# Altium schematic sheet 02-ESP-WROOM-32.SchDoc: ESP32, LCD, I2C IOs  and USB
size A3; SheetNumber: 3; SheetTotal: 6
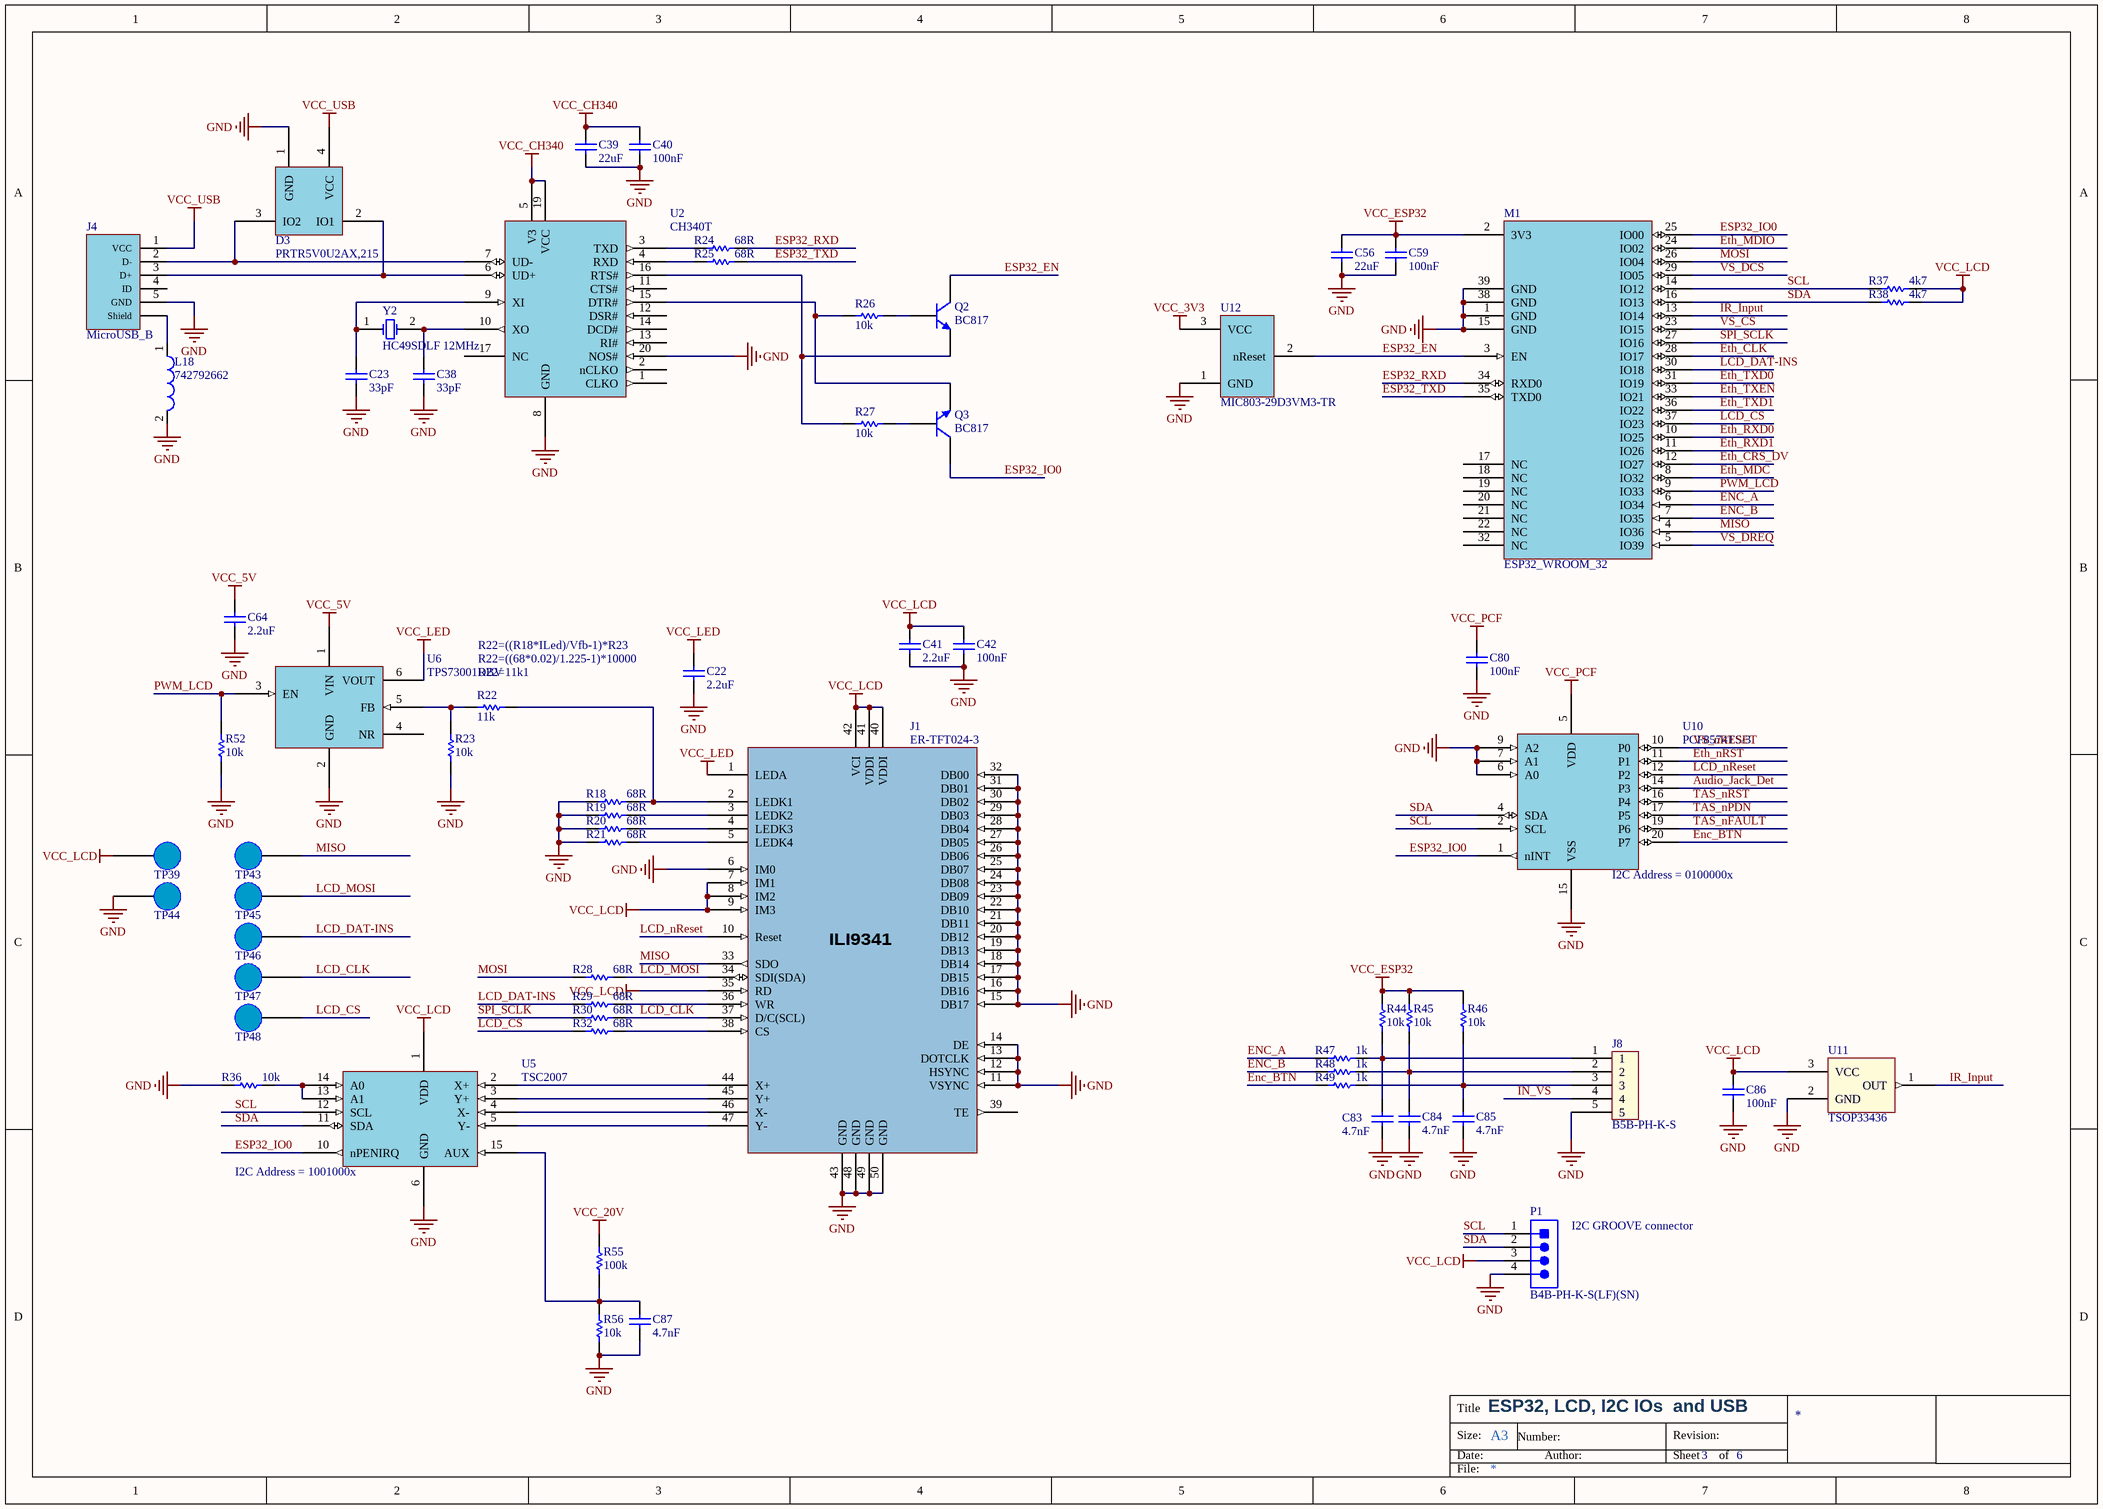
[diagram p0: 02-ESP-WROOM-32.SchDoc]

## Parts
C22  value 2.2uF  [CAPC1608X06N]  (hidden comment: 2.2uF 10V 0603 X5R)
C23  value 33pF  [CAPC1608X06N]  (hidden comment: 33pF 50V 0603 NP0)
C38  value 33pF  [CAPC1608X06N]  (hidden comment: 33pF 50V 0603 NP0)
C39  value 22uF  [CAPC1608X06N]  (hidden comment: 22uF 6.3V 0603 X5R)
C40  value 100nF  [CAPC1608X06N]  (hidden comment: 100nF 25V 0603 X5R)
C41  value 2.2uF  [CAPC1608X06N]  (hidden comment: 2.2uF 10V 0603 X5R)
C42  value 100nF  [CAPC1608X06N]  (hidden comment: 100nF 25V 0603 X5R)
C56  value 22uF  [CAPC1608X06N]  (hidden comment: 22uF 6.3V 0603 X5R)
C59  value 100nF  [CAPC1608X06N]  (hidden comment: 100nF 25V 0603 X5R)
C64  value 2.2uF  [CAPC1608X06N]  (hidden comment: 2.2uF 10V 0603 X5R)
C80  value 100nF  [CAPC1608X06N]  (hidden comment: 100nF 25V 0603 X5R)
C83  value 4.7nF  [CAPC1608X06N]  (hidden comment: 4.7nF 50V 0603 X7R)
C84  value 4.7nF  [CAPC1608X06N]  (hidden comment: 4.7nF 50V 0603 X7R)
C85  value 4.7nF  [CAPC1608X06N]  (hidden comment: 4.7nF 50V 0603 X7R)
C86  value 100nF  [CAPC1608X06N]  (hidden comment: 100nF 25V 0603 X5R)
C87  value 4.7nF  [CAPC1608X06N]  (hidden comment: 4.7nF 50V 0603 X7R)
D3  PRTR5V0U2AX,215  [SOT190P230X120-4N]
J1  ER-TFT024-3  [62684-501100ALF]
J4  MicroUSB_B  [629105150521]
J8  B5B-PH-K-S  [JST-B5B-PH-K-S_V]
L18  742792662  [CAPC0603(1608)]
M1  ESP32_WROOM_32  [ESP-WROOM-32]
P1  B4B-PH-K-S(LF)(SN)  [JST-B4B-PH-K-S_V]
Q2  BC817  [SOT95P230X110-3N]
Q3  BC817  [SOT95P230X110-3N]
R18  value 68R  [RESC1608X06N]  (hidden comment: 68R_0603)
R19  value 68R  [RESC1608X06N]  (hidden comment: 68R_0603)
R20  value 68R  [RESC1608X06N]  (hidden comment: 68R_0603)
R21  value 68R  [RESC1608X06N]  (hidden comment: 68R_0603)
R22  value 11k  [RESC1608X06N]  (hidden comment: 11k_0603)
R23  value 10k  [RESC1608X06N]  (hidden comment: 10k_0603)
R24  value 68R  [RESC1608X06N]  (hidden comment: 68R_0603)
R25  value 68R  [RESC1608X06N]  (hidden comment: 68R_0603)
R26  value 10k  [RESC1608X06N]  (hidden comment: 10k_0603)
R27  value 10k  [RESC1608X06N]  (hidden comment: 10k_0603)
R28  value 68R  [RESC1608X06N]  (hidden comment: 68R_0603)
R29  value 68R  [RESC1608X06N]  (hidden comment: 68R_0603)
R30  value 68R  [RESC1608X06N]  (hidden comment: 68R_0603)
R32  value 68R  [RESC1608X06N]  (hidden comment: 68R_0603)
R36  value 10k  [RESC1608X06N]  (hidden comment: 10k_0603)
R37  value 4k7  [RESC1608X06N]  (hidden comment: 4k7_0603)
R38  value 4k7  [RESC1608X06N]  (hidden comment: 4k7_0603)
R44  value 10k  [RESC1608X06N]  (hidden comment: 10k_0603)
R45  value 10k  [RESC1608X06N]  (hidden comment: 10k_0603)
R46  value 10k  [RESC1608X06N]  (hidden comment: 10k_0603)
R47  value 1k  [RESC1608X06N]  (hidden comment: 1k_0603)
R48  value 1k  [RESC1608X06N]  (hidden comment: 1k_0603)
R49  value 1k  [RESC1608X06N]  (hidden comment: 1k_0603)
R52  value 10k  [RESC1608X06N]  (hidden comment: 10k_0603)
R55  value 100k  [RESC1608X06N]  (hidden comment: 100k_0603)
R56  value 10k  [RESC1608X06N]  (hidden comment: 10k_0603)
TP39  TP_1mm  [TP_1mm]  (value not drawn)  (no BOM)
TP43  TP_1mm  [TP_1mm]  (value not drawn)  (no BOM)
TP44  TP_1mm  [TP_1mm]  (value not drawn)  (no BOM)
TP45  TP_1mm  [TP_1mm]  (value not drawn)  (no BOM)
TP46  TP_1mm  [TP_1mm]  (value not drawn)  (no BOM)
TP47  TP_1mm  [TP_1mm]  (value not drawn)  (no BOM)
TP48  TP_1mm  [TP_1mm]  (value not drawn)  (no BOM)
U2  CH340T  [TSOP65P780X120-20N]
U5  TSC2007  [TSOP65P640X120-16N]
U6  TPS73001DBV  [SOT95P245X110-6N]
U10  PCF8574TS/3  [TSOP65P640X120-20N]
U11  TSOP33436  [TSOP332]
U12  MIC803-29D3VM3-TR  [SOT95P230X110-3N]
Y2  HC49SDLF 12MHz  [TXC 9C]

## Nets
GND: C22.1 C23.1 C38.1 C39.2 C40.2 C41.1 C42.2 C56.2 C59.2 C64.1 C80.2 C83.1 C84.1 C85.1 C86.2 C87.1 D3.1(GND) J1.6(IM0) J1.11(VSYNC) J1.12(HSYNC) J1.13(DOTCLK) J1.14(DE) J1.15(DB17) J1.16(DB16) J1.17(DB15) J1.18(DB14) J1.19(DB13) J1.20(DB12) J1.21(DB11) J1.22(DB10) J1.23(DB09) J1.24(DB08) J1.25(DB07) J1.26(DB06) J1.27(DB05) J1.28(DB04) J1.29(DB03) J1.30(DB02) J1.31(DB01) J1.32(DB00) J1.43(GND) J1.48(GND) J1.49(GND) J1.50(GND) J4.5(GND) J8.5 L18.2 M1.1(GND) M1.15(GND) M1.38(GND) M1.39(GND) P1.4 R18.1 R19.1 R20.1 R21.1 R23.1 R36.2 R52.1 R56.1 TP44.1 U2.8(GND) U2.20(NOS#) U5.6(GND) U6.2(GND) U10.6(A0) U10.7(A1) U10.9(A2) U10.15(VSS) U11.2(GND) U12.1(GND)
VCC_3V3: U12.3(VCC)
VCC_5V: C64.2 U6.1(VIN)
VCC_20V: R55.2
VCC_CH340: C39.1 C40.1 U2.5(V3) U2.19(VCC)
VCC_ESP32: C56.1 C59.1 M1.2(3V3) R44.2 R45.2 R46.2
VCC_LCD: C41.2 C42.1 C86.1 J1.7(IM1) J1.8(IM2) J1.9(IM3) J1.35(RD) J1.40(VDDI) J1.41(VDDI) J1.42(VCI) P1.3 R37.2 R38.2 TP39.1 U5.1(VDD) U11.3(VCC)
VCC_LED: C22.2 J1.1(LEDA) U6.6(VOUT)
VCC_PCF: C80.1 U10.5(VDD)
VCC_USB: D3.4(VCC) J4.1(VCC)
Audio_Jack_Det: U10.14(P3)
ENC_A: M1.6(IO34) R47.1
ENC_B: M1.7(IO35) R48.1
Enc_BTN: R49.1 U10.20(P7)
ESP32_EN: M1.3(EN) Q2.3(C) U12.2(nReset)
ESP32_IO0: M1.25(IO00) Q3.3(C) U5.10(nPENIRQ) U10.1(nINT)
ESP32_RXD: M1.34(RXD0) R24.2
ESP32_TXD: M1.35(TXD0) R25.2
Eth_CLK: M1.28(IO17)
Eth_CRS_DV: M1.12(IO27)
Eth_MDC: M1.8(IO32)
Eth_MDIO: M1.24(IO02)
Eth_nRST: U10.11(P1)
Eth_RXD0: M1.10(IO25)
Eth_RXD1: M1.11(IO26)
Eth_TXD0: M1.31(IO19)
Eth_TXD1: M1.36(IO22)
Eth_TXEN: M1.33(IO21)
IN_VS: J8.4
IR_Input: M1.13(IO14) U11.1(OUT)
LCD_CLK: J1.37(D/C(SCL)) R30.2 TP47.1
LCD_CS: M1.37(IO23) R32.1 TP48.1
LCD_DAT-INS: M1.30(IO18) R29.1 TP46.1
LCD_MOSI: J1.34(SDI(SDA)) R28.2 TP45.1
LCD_nReset: J1.10(Reset) U10.12(P2)
MISO: J1.33(SDO) M1.4(IO36) TP43.1
MOSI: M1.26(IO04) R28.1
PWM_LCD: M1.9(IO33) R52.2 U6.3(EN)
SCL: M1.14(IO12) P1.1 R37.1 U5.12(SCL) U10.2(SCL)
SDA: M1.16(IO13) P1.2 R38.1 U5.11(SDA) U10.4(SDA)
SPI_SCLK: M1.27(IO16) R30.1
TAS_nFAULT: U10.19(P6)
TAS_nPDN: U10.17(P5)
TAS_nRST: U10.16(P4)
VS_CS: M1.23(IO15)
VS_DCS: M1.29(IO05)
VS_DREQ: M1.5(IO39)
VS_nRESET: U10.10(P0)
NetC23_2: C23.2 U2.9(XI) Y2.1(OSC1)
NetC38_2: C38.2 U2.10(XO) Y2.2(OSC2)
NetC83_2: C83.2 J8.1 R44.1 R47.2
NetC84_2: C84.2 J8.2 R45.1 R48.2
NetC85_2: C85.2 J8.3 R46.1 R49.2
NetC87_2: C87.2 R55.1 R56.2 U5.15(AUX)
NetD3_2: D3.2(IO1) J4.3(D+) U2.6(UD+)
NetD3_3: D3.3(IO2) J4.2(D-) U2.7(UD-)
NetJ1_2: J1.2(LEDK1) R18.2 R22.2
NetJ1_3: J1.3(LEDK2) R19.2
NetJ1_4: J1.4(LEDK3) R20.2
NetJ1_5: J1.5(LEDK4) R21.2
NetJ1_36: J1.36(WR) R29.2
NetJ1_38: J1.38(CS) R32.2
NetJ1_44: J1.44(X+) U5.2(X+)
NetJ1_45: J1.45(Y+) U5.3(Y+)
NetJ1_46: J1.46(X-) U5.4(X-)
NetJ1_47: J1.47(Y-) U5.5(Y-)
NetJ4_Shell: J4.Shell(Shield) L18.1
NetQ2_1: Q2.1(B) R26.1
NetQ2_2: Q2.2(E) R27.2 U2.16(RTS#)
NetQ3_1: Q3.1(B) R27.1
NetQ3_2: Q3.2(E) R26.2 U2.15(DTR#)
NetR22_1: R22.1 R23.2 U6.5(FB)
NetR24_1: R24.1 U2.3(TXD)
NetR25_1: R25.1 U2.4(RXD)
NetR36_1: R36.1 U5.13(A1) U5.14(A0)

Not connected (* = marked no-connect by the designer): J1 39(TE); J4 4(ID); M1 17(NC) 18(NC) 19(NC) 20(NC) 21(NC) 22(NC) 32(NC); U2 1(CLKO) 2(nCLKO) 11(CTS#) 12(DSR#) 13(RI#) 14(DCD#) 17(NC); U6 4(NR)

## Notes on the sheet
- R22=((R18*ILed)/Vfb-1)*R23
- R22=((68*0.02)/1.225-1)*10000
- (near R22) R22=11k1
- (near U10) I2C Address = 0100000x
- (near U5) I2C Address = 1001000x
- (near P1) I2C GROOVE connector
- Title
- Size:
- Date:
- A3
- Number:
- Author:
- Revision:
- Sheet
- of
- File:
- (in symbol ER-TFT024-3) ILI9341

## Library data of the parts
C22 C41 C64 = 2.2uF 10V 0603 X5R: Tolerance: 10%; Voltage: 10V; Supplier1: Digikey; Supplier2: Mouser; Supplier3: Farnell; RefSupplier1: 1276-1085-1-ND; RefSupplier2: *; RefSupplier3: *; Case: 0603; Material: X5R
C23 C38 = 33pF 50V 0603 NP0: Tolerance: 10%; Voltage: 50V; Supplier1: Digikey; Supplier2: Mouser; Supplier3: Farnell; RefSupplier1: 490-1415-1-ND; RefSupplier2: *; RefSupplier3: *; Case: 0603; Material: NP0
C39 C56 = 22uF 6.3V 0603 X5R: Tolerance: 10%; Voltage: 6.3V; Supplier1: Digikey; Supplier2: Mouser; Supplier3: Farnell; RefSupplier1: 445-8028-2-ND; RefSupplier2: *; RefSupplier3: *; Case: 0603; Material: X5R
C40 C42 C59 C80 C86 = 100nF 25V 0603 X5R: Tolerance: 10%; Voltage: 25V; Supplier1: Digikey; Supplier2: Mouser; Supplier3: Farnell; RefSupplier1: 587-1245-1-ND; RefSupplier2: *; RefSupplier3: *; Case: 0603; Material: X5R
C83-C85 C87 = 4.7nF 50V 0603 X7R: Tolerance: 10%; Voltage: 50V; Supplier1: Digikey; Supplier2: Mouser; Supplier3: Farnell; RefSupplier1: 490-12741-1-ND; RefSupplier2: *; RefSupplier3: *; Case: 0603; Material: X7R
D3 = PRTR5V0U2AX,215: Ultra low capacitance double rail-to-rail ESD protection diode; Manufacturer: Nexperia; PartNumber: PRTR5V0U2AX,215; Case: SOT-143-B
J1 = ER-TFT024-3: Connector for 240x320 dots 2.4" color tft lcd module; Manufacturer: Amphenol FCI; PartNumber: 62684-501100ALF
J4 = MicroUSB_B: Micro USB 2.0 SMT Type B Horizontal; Manufacturer: Wurth Elektronik; PartNumber: 629105150521
J8 = B5B-PH-K-S: JST  B5B-PH 2mm Pitch 5pins TH; Manufacturer: JST; PartNumber: B5B-PH-K-S
L18 = CMP-0220-00178-1: SMD EMI Suppression Ferrite Bead WE-CBF, Z = 1000 Ohm; Manufacturer: Wurth; PackageDescription: Chip Inductor, 2-Leads, Body 1.6 x 0.8 mm; PackageVersion: 2009; PackageReference: SMD-0603; ComponentLink1URL: http://www.we-online.com; ComponentLink2URL: http://www.we-online.de/katalog/media/pdf/742792662.pdf; Impedance: 1000 Ohm; DatasheetVersion: ver 1, Mar-2010; ComponentLink1Description: Manufacturer Link; ComponentLink2Description: Datasheet; RefManufacturer: 742792662
M1 = ESP32_WROOM_32: Manufacturer: Espressif Systems; PartNumber: ESP32_WROOM_32
P1 = CMP-2000-05165-1: Male Header, Pitch 2 mm, 1 x 4 Position; Manufacturer: JST; No of Positions: 4; Style/Orientation: StraightHeader/Plug; Pitch: 2mm; Datasheet URL: http://datasheet.octopart.com/B4B-PH-K-S%28LF%29%28SN%29-JST-datasheet-10558886.pdf; Type: ShroudedHeader; Manufacturer URL: http://www.jst.com/home2.html; Termination: Crimp; Datasheet Version: Apr-09; PartNumber: B4B-PH-K-S(LF)(SN)
Q2 Q3 = BC817_SOT23: BC817 NPN  45V SOT23; PartNumber: BC817-40,215; Manufacturer: Nexperia; Case: SOT23; Supplier1: Digikey; RefSupplier1: 1727-2919-1-ND
R18-R21 R24 R25 R28-R30 R32 = 68R: Resistor 68R 0603 1%; Case: 0603; Tolerance: 1%; Size: 0603, 1.6x0.8x0.8mm; RefSupplier1: 311-68.0HRCT-ND; RefSupplier2: *; RefSupplier3: *; Supplier1: Digikey; Supplier2: *; Supplier3: *
R22 = 11k: Resistor 11k 0603 1%; Case: 0603; Tolerance: 1%; Size: 0603, 1.6x0.8x0.8mm; RefSupplier1: 311-11KGRCT-ND; RefSupplier2: *; RefSupplier3: *; Supplier1: Digikey; Supplier2: *; Supplier3: *
R23 R26 R27 R36 R44-R46 R52 R56 = 10k: Resistor 10k 0603 1%; Case: 0603; Tolerance: 1%; Size: 0603, 1.6x0.8x0.8mm; RefSupplier1: 311-10.0KHRCT-ND; RefSupplier2: *; RefSupplier3: *; Supplier1: Digikey; Supplier2: *; Supplier3: *
R37 R38 = 4k7: Resistor 4k7 0603 1%; Case: 0603; Tolerance: 1%; Size: 0603, 1.6x0.8x0.8mm; Supplier1: Digikey; Supplier2: *; Supplier3: *; RefSupplier1: 311-4.70KHRCT-ND; RefSupplier2: *; RefSupplier3: *
R47-R49 = 1k: Resistor 1k 0603 1%; Case: 0603; Tolerance: 1%; Size: 0603, 1.6x0.8x0.8mm; Supplier1: Digikey; Supplier2: Mouser; Supplier3: Farnell; RefSupplier1: 311-1.00KHRCT-ND; RefSupplier2: *; RefSupplier3: *
R55 = 100k: Resistor 100k 0603 1%; Case: 0603; Tolerance: 1%; Supplier1: Digikey; Supplier2: *; Supplier3: *; RefSupplier1: 311-100KHRCT-ND; RefSupplier2: *; RefSupplier3: *
TP39 TP43-TP48 = TP_1mm: Test point 1mm round SMD
U2 = CH340T: CH340T USB to Serial; Manufacturer: WCH; PartNumber: CH340T; Case: TSOP20
U5 = TSC2007: TSSOP I2C Resistive Touch Controller; PartNumber: TSC2007IPWR; Manufacturer: TI; Case: TSOP16
U6 = TPS73001DBV: TPS730 ADJ 200mA SOT23-6 LDO; Manufacturer: TI; PartNumber: TPS73001DBV; Case: SOT23-6
U10 = PCF8574TS/3: PCF8574TS/3 SSOP20 I2C I/O Expander; Manufacturer: NXP; PartNumber: PCF8574TS/3; Case: SSOP20
U11 = TSOP33436: TSOP33436 IR 36kHz Receiver; Manufacturer: Vishay; PartNumber: TSOP33436
U12 = MIC803-29D3VM3-TR: Reset 2.93V open drain sot23 MIC803-29D3VM3-TR; Manufacturer: Microchip; PartNumber: MIC803-29D3VM3-TR; Case: SOT23
Y2 = HC49SDLF 12.000MHz: 12.0000MHz Crystal HC49 SMT 20ppm; PartNumber: GC1200052; Manufacturer: Diodes; Value: 12MHz; Tolerance: 20ppm; Supplier1: Digikey; RefSupplier1: GC1200052CT-ND; Case: HC49S